# EAGLE design Circuit (EAGLE 8.6.3)
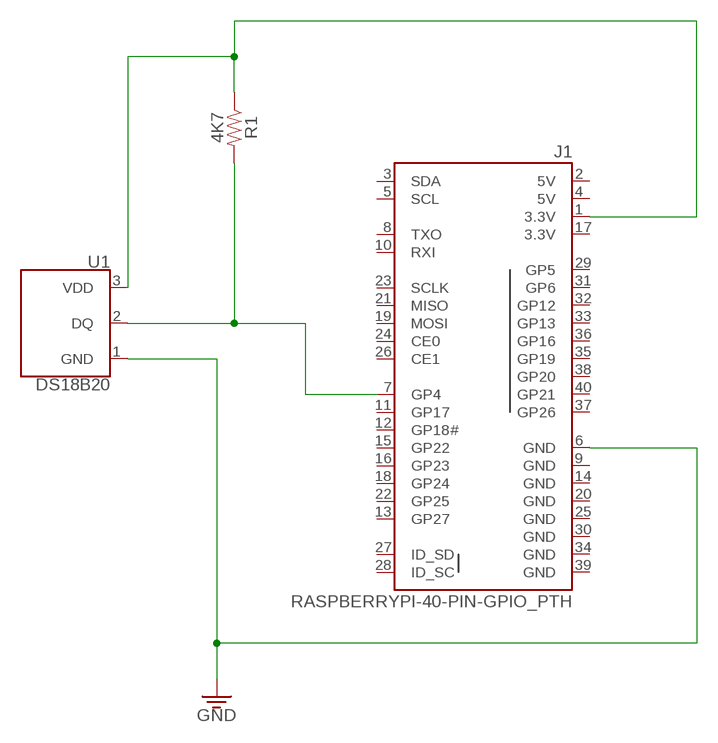
[diagram p0: schematic, sheet 1]

## Parts
J1  RASPBERRYPI-40-PIN-GPIO_PTH  [2X20_SHROUDED]
R1  4K7  RESISTORAXIAL-0.3  [AXIAL-0.3]
U1  DS18B20  [TO-92-AMMO]

## Nets
3.3V: J1.6(GND) U1.1(GND) ; supply symbol labelled GND
N$1: J1.1(3.3V) R1.P$1 U1.3(VDD)
N$2: J1.7(GP4) R1.P$2 U1.2(DQ)
Unconnected: J1.3(SDA) J1.5(SCL) J1.8(TXO) J1.10(RXI) J1.11(GP17) J1.12(GP18#) J1.13(GP27) J1.15(GP22) J1.16(GP23) J1.18(GP24) J1.19(MOSI) J1.21(MISO) J1.22(GP25) J1.23(SCLK) J1.24(CE0) J1.26(CE1) J1.27(ID_SD) J1.28(ID_SC) J1.29(GP5) J1.31(GP6) J1.32(GP12) J1.33(GP13) J1.35(GP19) J1.36(GP16) J1.37(GP26) J1.38(GP20) J1.40(GP21)

## Power pins joined to a net without a drawn wire
3.3V: J1.17(3.3V)
5V: J1.2(5V) J1.4(5V)
GND: J1.9(GND) J1.14(GND) J1.20(GND) J1.25(GND) J1.30(GND) J1.34(GND) J1.39(GND)

## Library data of the parts
J1 = SparkFun-Connectors:RASPBERRYPI-40-PIN-GPIO: Raspberry Pi GPIO Header 2x20 pin connector, as found on B, B+, A+ models. Both shrouded PTH and SMT versions available. SparkFun Products: GPIO Shrouded Header <https://www.sparkfun.com/products/13054>- PTH SparkFun Pi Wedge (Preassembled) <https://www.sparkfun.com/products/13717>; PROD_ID: CONN-12263; SF_ID: PRT-13054
R1 = SparkFun-Resistors:RESISTOR: Generic Resistor Package
U1 = SparkFun-Sensors:DS18B20: Dallas/Maxim DS18B20 1-Wire Temperature Sensor The DS18B20 reports degrees C with 9 to 12-bit precision, -55C to 125C (+/-0.5C). Each sensor has a unique 64-Bit Serial number etched into it - allows for a huge number of sensors to be used on one data bus. Datasheet <http://datasheets.maximintegrated.com/en/ds/DS18B20.pdf> SparkFun Products One Wire Digital Temperature Sensor - DS18B20 <https://www.sparkfun.com/products/245> (SEN-00245); SPICEPREFIX: U; STORE_ID: SEN-00245

## Board
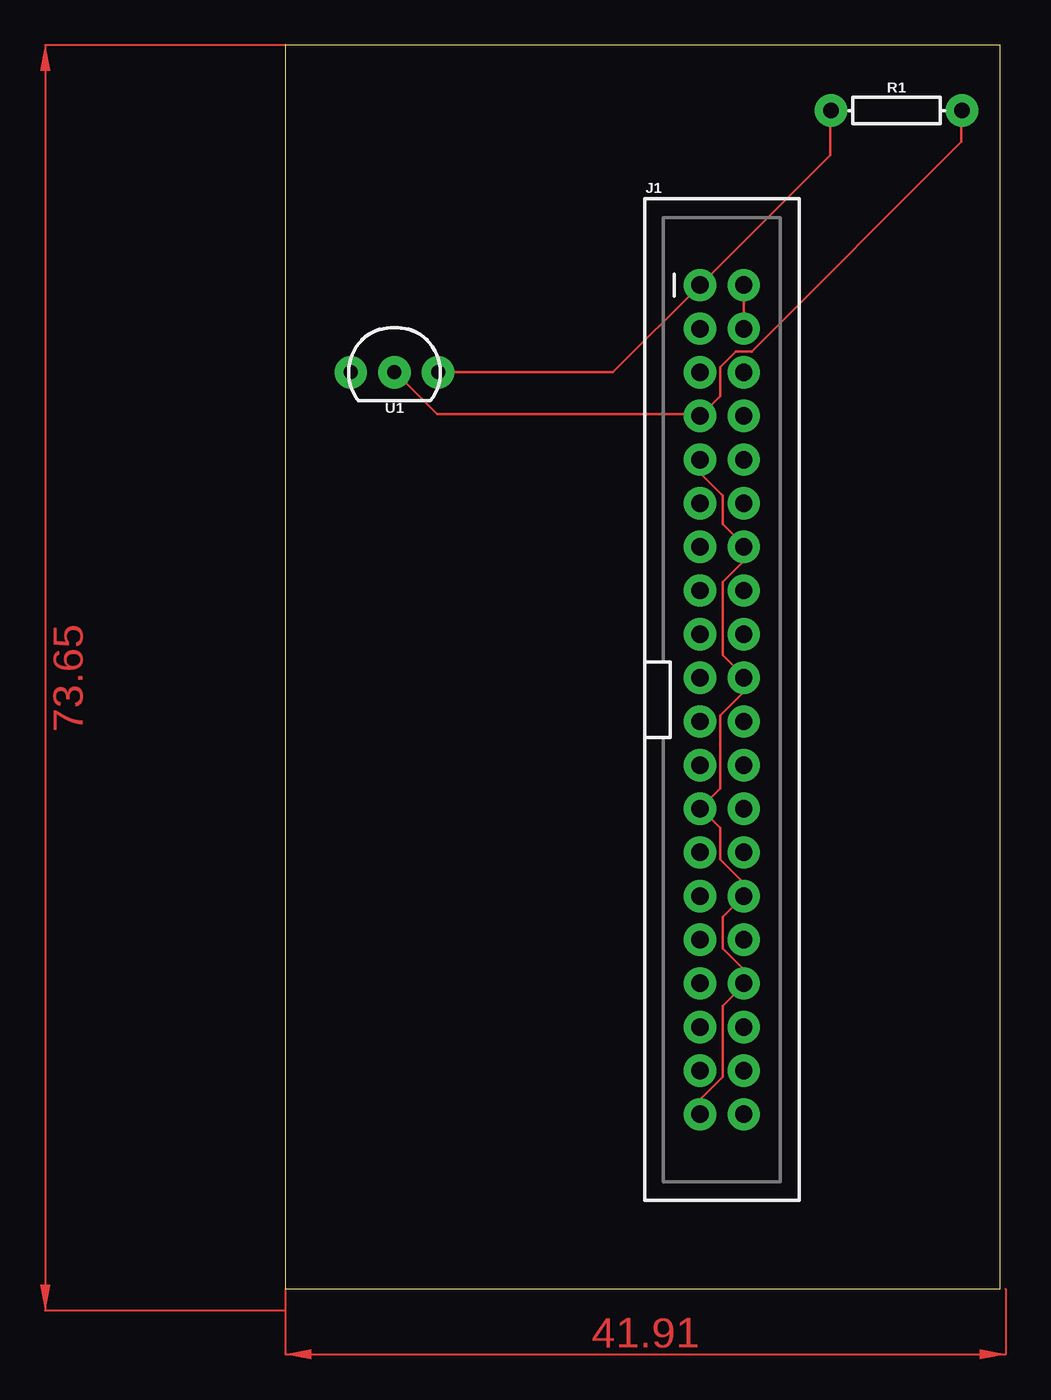
[diagram p1: board, top side]
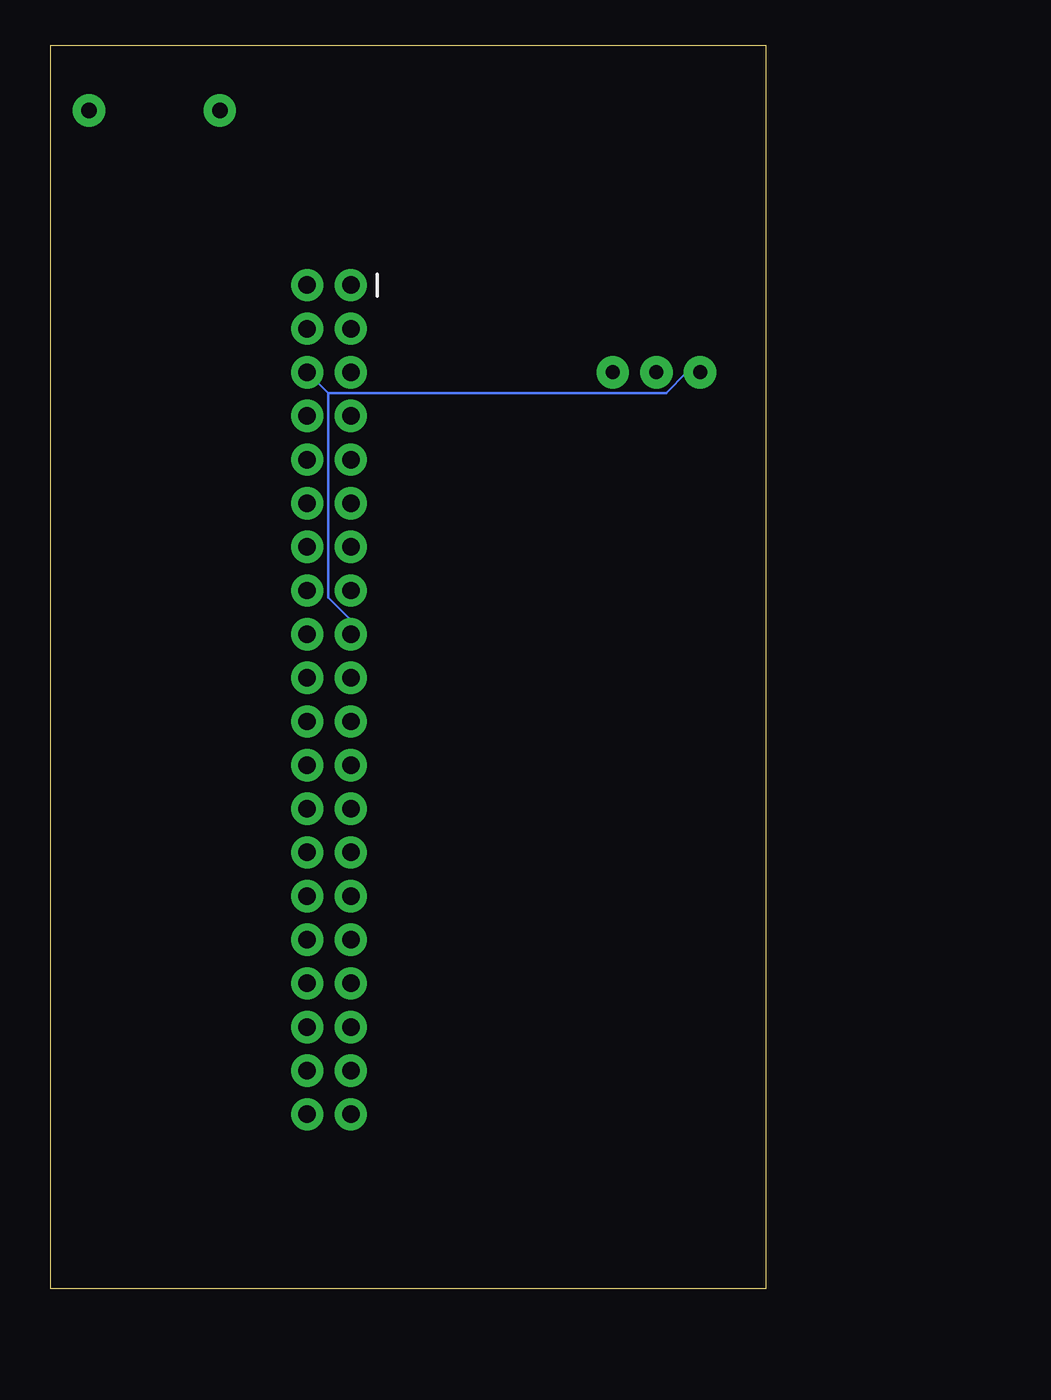
[diagram p2: board, bottom side, seen from below]

Size 41.58 x 72.38 mm. Coordinates in mm from the lower left corner, seen from the top.
Outline: 0,0 41.58,0 41.58,72.38 0,72.38 0,0
Copper layers (1*16): Top 0.035mm / dielectric 1.5mm / Bottom 0.035mm
Design rules "default": minimum track width 6mil, minimum drill 0.35mm, track to track 6mil, track to pad 6mil, pad to pad 6mil, via to via 6mil, smd to smd 6mil, copper to edge 40mil, drill to drill 6mil, minimum pad ring 10mil, minimum via ring 8mil, stop-mask expansion 4mil, vias tented up to drill 0mil, thermal gap 10mil

### Footprints (pad centres in the part's own frame; a part is rotated, then mirrored left to right if it is on the bottom)
2X20_SHROUDED = drill 1.016 pad 1.88: 1 -1.27,24.13; 2 1.27,24.13; 3 -1.27,21.59; 4 1.27,21.59; 5 -1.27,19.05; 6 1.27,19.05; 7 -1.27,16.51; 8 1.27,16.51; 9 -1.27,13.97; 10 1.27,13.97; 11 -1.27,11.43; 12 1.27,11.43; 13 -1.27,8.89; 14 1.27,8.89; 15 -1.27,6.35; 16 1.27,6.35; 17 -1.27,3.81; 18 1.27,3.81; 19 -1.27,1.27; 20 1.27,1.27; 21 -1.27,-1.27; 22 1.27,-1.27; 23 -1.27,-3.81; 24 1.27,-3.81; 25 -1.27,-6.35; 26 1.27,-6.35; 27 -1.27,-8.89; 28 1.27,-8.89; 29 -1.27,-11.43; 30 1.27,-11.43; 31 -1.27,-13.97; 32 1.27,-13.97; 33 -1.27,-16.51; 34 1.27,-16.51; 35 -1.27,-19.05; 36 1.27,-19.05; 37 -1.27,-21.59; 38 1.27,-21.59; 39 -1.27,-24.13; 40 1.27,-24.13
AXIAL-0.3 = drill 0.9 pad 1.88: P$1 -3.81,0; P$2 3.81,0
TO-92-AMMO = drill 0.813 pad 1.88: 1 -2.54,0; 2 0,0; 3 2.54,0

### Placement (x,y rotation side)
J1  25.4,34.29 0 top
R1  35.56,68.58 0 top
U1  6.35,53.34 0 top

### Tracks (layer width: path | path; a pad name or v marks a point on that pad's centre or on a via)
3.3V
  Bottom 0.152: 25.45,52.12 25.45,40.23 24.23,39.01 24.23,38.1 J1.17 | J1.6 25.45,52.12 | U1.1 4.57,53.34 5.79,52.12 25.45,52.12
5V
  Top 0.152: J1.2 J1.4
GND
  Top 0.152: J1.39 24.23,10.21 24.23,11.12 25.45,12.34 25.45,16.46 26.67,17.68 J1.34 26.67,18.59 25.45,19.81 25.45,21.64 J1.30 26.67,23.62 25.3,24.99 25.3,26.82 24.23,27.89 J1.25 25.3,29.11 25.3,33.38 26.67,34.75 J1.20 26.67,35.66 25.45,36.88 25.45,41.15 26.67,42.37 J1.14 26.67,43.28 25.45,44.5 25.45,46.18 24.23,47.4 24.23,48.16 J1.9
N$1
  Top 0.152: U1.3 19.05,53.34 J1.1 31.7,65.99 31.7,68.58 R1.P$1
N$2
  Top 0.152: U1.2 6.4,53.34 8.84,50.9 24.08,50.9 J1.7 25.3,51.97 25.3,53.65 26.21,54.56 27.13,54.56 39.32,66.75 39.32,68.58 R1.P$2
(copper drawn outside any net)
  shapes: Top area x2